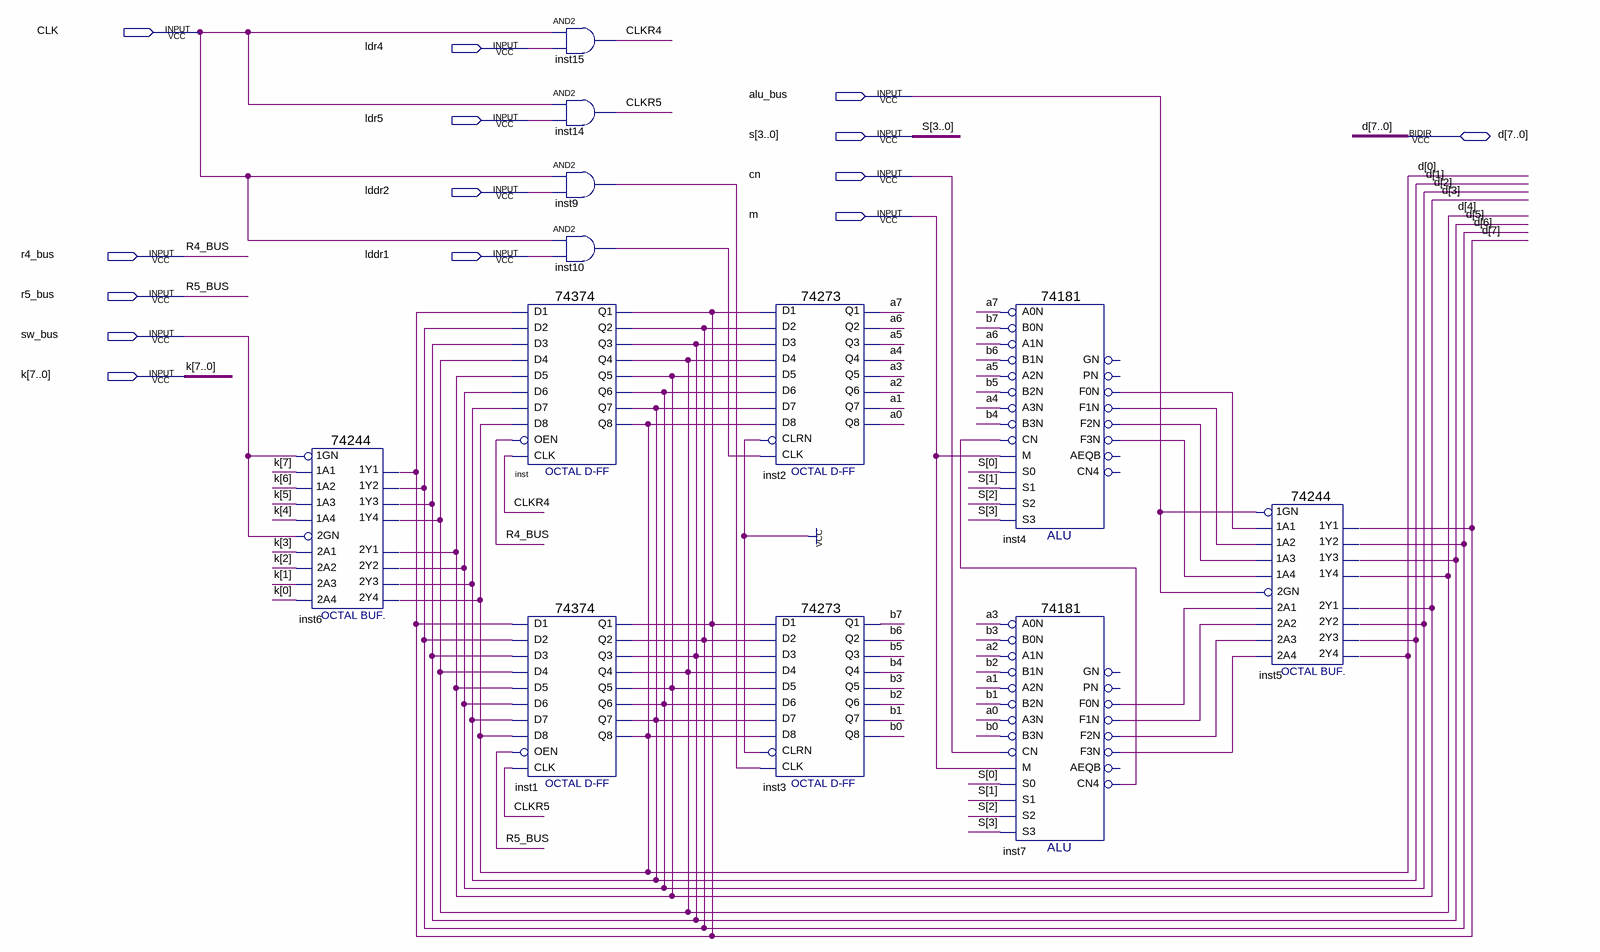
[diagram p0: schematic sheet]
// Quartus schematic zjw_yunsuanqi.bdf as structural Verilog: 12 symbols, 14 pins
module zjw_yunsuanqi (
  input  CLK,
  input  ldr4,
  input  alu_bus,
  input  ldr5,
  input  [3:0] s,
  input  cn,
  input  lddr2,
  input  m,
  input  r4_bus,
  input  lddr1,
  input  r5_bus,
  input  sw_bus,
  input  [7:0] k,
  inout  [7:0] d
);

  wire a0, a1, a2, a3, a4, a5, a6, a7, b0, b1, b2, b3, b4, b5, b6, b7, CLKR4, CLKR5, inst4_f0n, inst4_f1n,
       inst4_f2n, inst4_f3n, inst7_cn4, inst7_f0n, inst7_f1n, inst7_f2n, inst7_f3n, inst9_out, inst10_out;

  \74244  inst6 (
    .\1A2 (k[6]), .\1A4 (k[4]), .\1A1 (k[7]), .\1A3 (k[5]), .\1GN (sw_bus), .\2A3 (k[1]), .\2GN (sw_bus),
    .\2A1 (k[3]), .\2A4 (k[0]), .\2A2 (k[2]), .\1Y2 (d[6]), .\1Y4 (d[4]), .\2Y1 (d[3]), .\1Y1 (d[7]),
    .\2Y3 (d[1]), .\2Y4 (d[0]), .\1Y3 (d[5]), .\2Y2 (d[2]));
  \74374  inst (
    .D1(d[7]), .D2(d[6]), .D3(d[5]), .D4(d[4]), .D6(d[2]), .D5(d[3]), .OEN(r4_bus), .D8(d[0]), .D7(d[1]),
    .CLK(CLKR4), .Q2(d[6]), .Q3(d[5]), .Q5(d[3]), .Q4(d[4]), .Q6(d[2]), .Q7(d[1]), .Q8(d[0]), .Q1(d[7]));
  \74374  inst1 (
    .D1(d[7]), .D2(d[6]), .D3(d[5]), .D4(d[4]), .D6(d[2]), .D5(d[3]), .OEN(r5_bus), .D8(d[0]), .D7(d[1]),
    .CLK(CLKR5), .Q2(d[6]), .Q3(d[5]), .Q5(d[3]), .Q4(d[4]), .Q6(d[2]), .Q7(d[1]), .Q8(d[0]), .Q1(d[7]));
  and inst15 (CLKR4, CLK, ldr4);
  and inst14 (CLKR5, CLK, ldr5);
  and inst9 (inst9_out, CLK, lddr2);
  and inst10 (inst10_out, CLK, lddr1);
  \74273  inst2 (
    .D2(d[6]), .D3(d[5]), .D1(d[7]), .D4(d[4]), .D7(d[1]), .D6(d[2]), .D5(d[3]), .D8(d[0]), .CLK(inst10_out),
    .CLRN(1'b1), .Q4(a4), .Q1(a7), .Q2(a6), .Q3(a5), .Q6(a2), .Q5(a3), .Q7(a1), .Q8(a0));
  \74273  inst3 (
    .D2(d[6]), .D3(d[5]), .D1(d[7]), .D4(d[4]), .D7(d[1]), .D6(d[2]), .D5(d[3]), .D8(d[0]), .CLK(inst9_out),
    .CLRN(1'b1), .Q4(b4), .Q1(b7), .Q2(b6), .Q3(b5), .Q6(b2), .Q5(b3), .Q7(b1), .Q8(b0));
  \74181  inst4 (
    .B0N(b7), .A0N(a7), .A1N(a6), .B1N(b6), .A3N(a4), .B2N(b5), .A2N(a5), .M(m), .CN(inst7_cn4), .B3N(b4),
    .S2(s[2]), .S1(s[1]), .S0(s[0]), .S3(s[3]), .F3N(inst4_f3n), .F1N(inst4_f1n), .F0N(inst4_f0n),
    .F2N(inst4_f2n));  // open: PN, GN, AEQB, CN4
  \74181  inst7 (
    .B0N(b3), .A0N(a3), .A1N(a2), .B1N(b2), .A3N(a0), .B2N(b1), .A2N(a1), .M(m), .CN(cn), .B3N(b0),
    .S2(s[2]), .S1(s[1]), .S0(s[0]), .S3(s[3]), .F3N(inst7_f3n), .F1N(inst7_f1n), .F0N(inst7_f0n),
    .CN4(inst7_cn4), .F2N(inst7_f2n));  // open: PN, GN, AEQB
  \74244  inst5 (
    .\1A2 (inst4_f1n), .\1A4 (inst4_f3n), .\1A1 (inst4_f0n), .\1A3 (inst4_f2n), .\1GN (alu_bus),
    .\2A3 (inst7_f2n), .\2GN (alu_bus), .\2A1 (inst7_f0n), .\2A4 (inst7_f3n), .\2A2 (inst7_f1n),
    .\1Y2 (d[6]), .\1Y4 (d[4]), .\2Y1 (d[3]), .\1Y1 (d[7]), .\2Y3 (d[1]), .\2Y4 (d[0]), .\1Y3 (d[5]),
    .\2Y2 (d[2]));
endmodule
